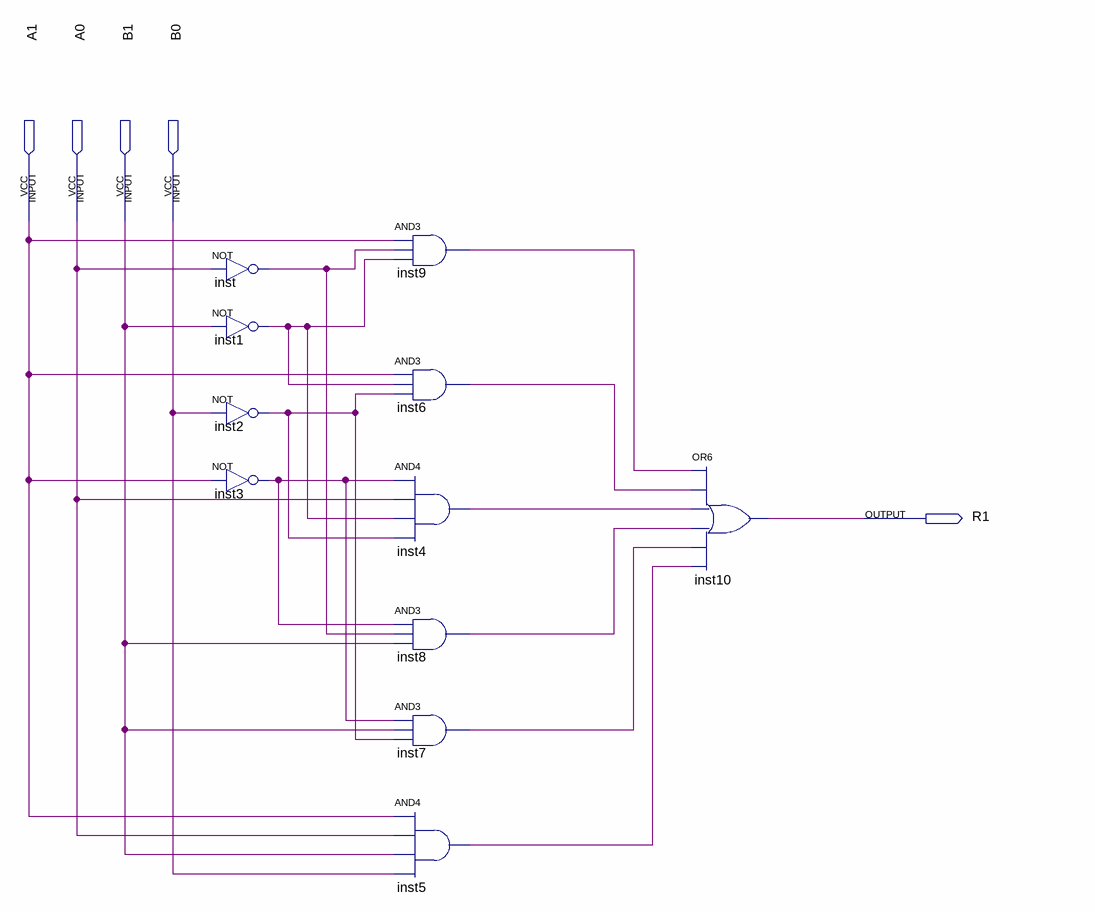
[diagram p0: schematic sheet]
// Quartus schematic LAB03_BlockR1.bdf as structural Verilog: 11 symbols, 5 pins
module LAB03_BlockR1 (
  input  A1,
  input  A0,
  input  B1,
  input  B0,
  output R1
);

  wire inst1_out, inst2_out, inst3_out, inst4_out, inst5_out, inst6_out, inst7_out, inst8_out, inst9_out,
       inst_out;

  not inst (inst_out, A0);
  not inst1 (inst1_out, B1);
  not inst2 (inst2_out, B0);
  not inst3 (inst3_out, A1);
  and inst9 (inst9_out, A1, inst_out, inst1_out);
  and inst6 (inst6_out, A1, inst1_out, inst2_out);
  and inst4 (inst4_out, inst3_out, A0, inst1_out, inst2_out);
  and inst8 (inst8_out, inst3_out, inst_out, B1);
  and inst7 (inst7_out, inst3_out, B1, inst2_out);
  and inst5 (inst5_out, A1, A0, B1, B0);
  or inst10 (R1, inst9_out, inst6_out, inst4_out, inst8_out, inst7_out, inst5_out);
endmodule
